# EAGLE schematic AquaTank (EAGLE 9.5.1)
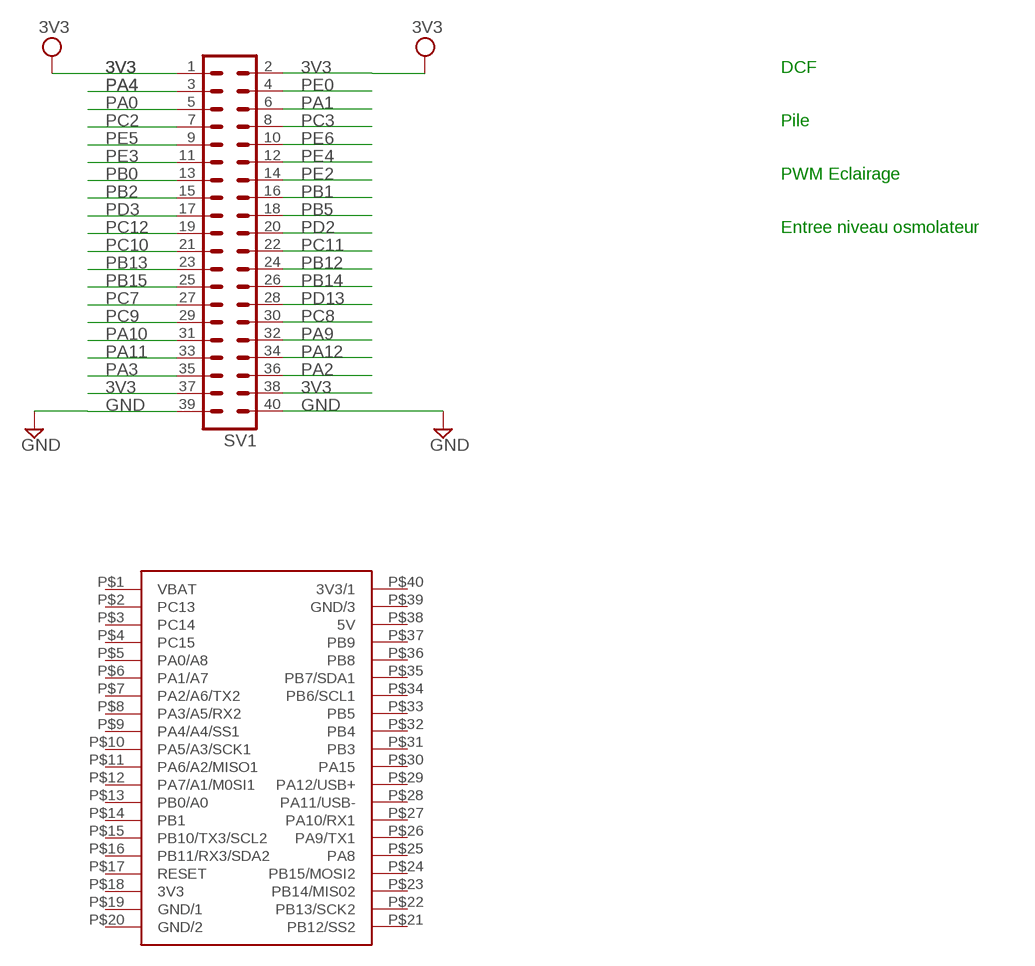
[diagram p0: schematic, sheet 1]

## Parts
SV1  MA20-2  [MA20-2]
U$1  BLUEPILL  [BLUEPILL]

## Nets
3V3: SV1.1 SV1.2 SV1.37 SV1.38
GND: SV1.39 SV1.40
PA0: SV1.5
PA1: SV1.6
PA2: SV1.36
PA3: SV1.35
PA4: SV1.3
PA9: SV1.32
PA10: SV1.31
PA11: SV1.33
PA12: SV1.34
PB0: SV1.13
PB1: SV1.16
PB2: SV1.15
PB5: SV1.18
PB12: SV1.24
PB13: SV1.23
PB14: SV1.26
PB15: SV1.25
PC2: SV1.7
PC3: SV1.8
PC7: SV1.27
PC8: SV1.30
PC9: SV1.29
PC10: SV1.21
PC11: SV1.22
PC12: SV1.19
PD2: SV1.20
PD3: SV1.17
PD13: SV1.28
PE0: SV1.4
PE2: SV1.14
PE3: SV1.11
PE4: SV1.12
PE5: SV1.9
PE6: SV1.10
Unconnected: U$1.P$1(VBAT) U$1.P$2(PC13) U$1.P$3(PC14) U$1.P$4(PC15) U$1.P$5(PA0/A8) U$1.P$6(PA1/A7) U$1.P$7(PA2/A6/TX2) U$1.P$8(PA3/A5/RX2) U$1.P$9(PA4/A4/SS1) U$1.P$10(PA5/A3/SCK1) U$1.P$11(PA6/A2/MISO1) U$1.P$12(PA7/A1/M0SI1) U$1.P$13(PB0/A0) U$1.P$14(PB1) U$1.P$15(PB10/TX3/SCL2) U$1.P$16(PB11/RX3/SDA2) U$1.P$17(RESET) U$1.P$18(3V3) U$1.P$19(GND/1) U$1.P$20(GND/2) U$1.P$21(PB12/SS2) U$1.P$22(PB13/SCK2) U$1.P$23(PB14/MIS02) U$1.P$24(PB15/MOSI2) U$1.P$25(PA8) U$1.P$26(PA9/TX1) U$1.P$27(PA10/RX1) U$1.P$28(PA11/USB-) U$1.P$29(PA12/USB+) U$1.P$30(PA15) U$1.P$31(PB3) U$1.P$32(PB4) U$1.P$33(PB5) U$1.P$34(PB6/SCL1) U$1.P$35(PB7/SDA1) U$1.P$36(PB8) U$1.P$37(PB9) U$1.P$38(5V) U$1.P$39(GND/3) U$1.P$40(3V3/1)

## Notes on the sheet
- DCF
- Pile
- PWM Eclairage
- Entree niveau osmolateur

## Library data of the parts
SV1 = con-lstb:MA20-2: PIN HEADER; OC_FARNELL: unknown; OC_NEWARK: unknown
U$1 = stm32duino boards:BLUEPILL